# Altium schematic sheet [00] ESP8266 CH340.SchDoc (part 2 of 3)
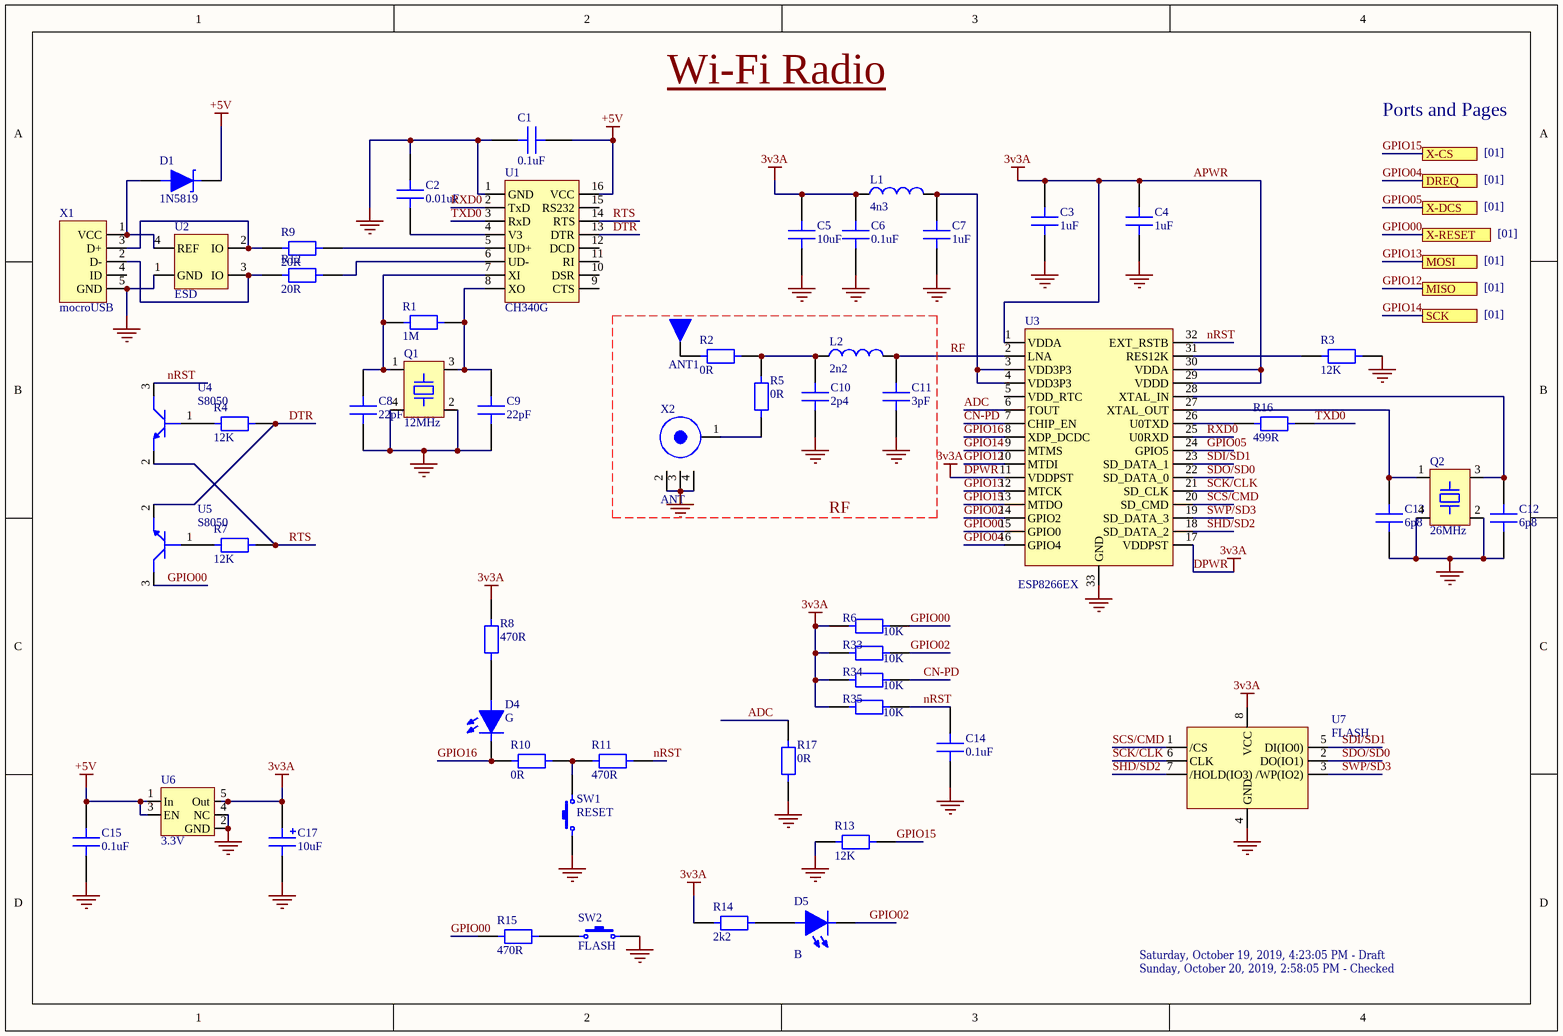
[diagram p1: [00] ESP8266 CH340.SchDoc]
## Library data of the parts
ANT1 = ANT WI-FI PCB 2.4GHz: ANT WIFI PCB TRACE ANTENNA 2.4GHz
C1 C15 = VJ0805Y104KXAAT: CAP CER 0.1uF 0805 50V X7R; Manufacturer: Vishay Vitramon; Capacitance: 100nF; Tolerance: 10%; Supplier 1: Digi-Key; Supplier Part Number 1: 720-1383-1-ND; Manufacturer Part Number: VJ0805Y104KXAAT; Stock 1: 145518; Mount: Surface Mount; Case/Package: 0805; Weight: 0.000194oz; Case Code (Metric): 2012; Case Code (Imperial): 0805; Min Operating Temperature: -55°C; Max Operating Temperature: 125°C; Package Quantity: 1; Packaging: Tape and Reel; Voltage Rating: 50V; Voltage Rating (DC): 50V; Dielectric: X7R; Termination: SMD/SMT; Voltage: 50V; Length: 2mm; Height: 1.45mm; Width: 0.049inch; Thickness: 0.057inch; Depth: 1.25mm; Radiation Hardening: No; REACH SVHC: Unknown; Lead Free: Lead Free; ComponentLink1URL: http://www.mouser.com/ds/2/427/vjcommercialseries-222796.pdf?src-supplier=Mouser; ComponentLink1Description: http://www.mouser.com/ds/2/427/vjcommercialseries-222796.pdf?src-supplier=Mouser; ComponentLink2URL: http://www.vishay.com/docs/45199/vjcommercialseries.pdf?src-supplier=Digi-Key; ComponentLink2Description: http://www.vishay.com/docs/45199/vjcommercialseries.pdf?src-supplier=Digi-Key; ComponentLink3URL: http://www.vishay.com/docs/45199/vjcommercialseries.pdf?src-supplier=Future+Electronics; ComponentLink3Description: http://www.vishay.com/docs/45199/vjcommercialseries.pdf?src-supplier=Future+Electronics
C2 = VJ0603Y103KXAAC: CAP CER 0.01uF 0603 10 nF 50 V ±10 % Tolerance X7R SMT Multilayer Ceramic Chip Capacitor; Manufacturer: Vishay Vitramon; Tolerance: 10%; Capacitance: 10nF; Voltage Rating: 50V; Supplier 1: Digi-Key; Supplier Part Number 1: 720-1376-1-ND; Manufacturer Part Number: VJ0603Y103KXAAC; Stock 1: 728512; Pricing 1: 1=0.26, 10=0.179, 100=0.1013, 500=0.0715, 1000=0.0625 (USD); Mount: Surface Mount; Case/Package: 0603; Number of Pins: 2; Weight: 7.1E-05oz; Case Code (Metric): 1608; Case Code (Imperial): 0603; Contact Plating: Tin,Matte; Min Operating Temperature: -55°C; Max Operating Temperature: 125°C; Packaging: Tape and Reel; Package Quantity: 4000; Voltage Rating (DC): 50V; Dielectric: X7R; Termination: SMD/SMT; Voltage: 50V; Length: 1.6mm; Height: 0.92mm; Width: 0.031inch; Thickness: 0.036inch; Depth: 0.8mm; Radiation Hardening: No; REACH SVHC: Unknown; Lead Free: Lead Free; ComponentLink1URL: http://www.farnell.com/datasheets/1805045.pdf?src-supplier=Element14; ComponentLink1Description: http://www.farnell.com/datasheets/1805045.pdf?src-supplier=Element14; ComponentLink2URL: http://www.farnell.com/datasheets/2049137.pdf?src-supplier=Element14; ComponentLink2Description: http://www.farnell.com/datasheets/2049137.pdf?src-supplier=Element14; ComponentLink3URL: http://www.farnell.com/datasheets/50102.pdf?src-supplier=Element14; ComponentLink3Description: http://www.farnell.com/datasheets/50102.pdf?src-supplier=Element14; ComponentLink4URL: http://www.vishay.com/docs/45051/vjvitramonpackaging.pdf?src-supplier=Digi-Key; ComponentLink4Description: http://www.vishay.com/docs/45051/vjvitramonpackaging.pdf?src-supplier=Digi-Key
C3 C4 C7 = VJ0603Y105KXJCW1BC: CAP CER 1uF 0603 16V X7R 10% SMD 125C Paper T/R; Manufacturer: Vishay Semiconductors; Dielectric Material: Tantalum; Supplier 1: Digi-Key; Supplier Part Number 1: 720-1852-1-ND; Manufacturer Part Number: VJ0603Y105KXJCW1BC; Stock 1: 970843; Pricing 1: 1=0.29, 10=0.196, 100=0.0991, 500=0.0678, 1000=0.06 (USD); Mount: Surface Mount; Case/Package: 0603; Min Operating Temperature: -55°C; Max Operating Temperature: 125°C; Capacitance: 1uF; Tolerance: 10%; Packaging: Tape and Reel; Dielectric: X7R; Voltage Rating (DC): 16V; Length: 1.6mm; Depth: 0.8mm; Radiation Hardening: No; Lead Free: Lead Free; ComponentLink1URL: http://www.vishay.com/docs/28548/vjw1bcbascomseries.pdf?src-supplier=Avnet; ComponentLink1Description: http://www.vishay.com/docs/28548/vjw1bcbascomseries.pdf?src-supplier=Avnet; ComponentLink2URL: http://www.vishay.com/docs/28548/vjw1bcbascomseries.pdf?src-supplier=Avnet+Europe; ComponentLink2Description: http://www.vishay.com/docs/28548/vjw1bcbascomseries.pdf?src-supplier=Avnet+Europe
C5 = C0603C106M9PACTU: CAP CER 10UF 0603 6.3V; Manufacturer: KEMET; Dielectric Material: Ceramic; Tolerance: 20%; Dielectric: X5R; Supplier 1: Digi-Key; Supplier Part Number 1: 399-5504-1-ND; Manufacturer Part Number: C0603C106M9PACTU; Stock 1: 97190; Pricing 1: 1=0.49, 10=0.34, 100=0.2042, 500=0.1531, 1000=0.1293 (USD); Mount: Surface Mount; Case/Package: 0603; Min Operating Temperature: -55°C; Max Operating Temperature: 85°C; Capacitance: 10uF; Packaging: Tape and Reel; Voltage: 6.3V; Termination: SMD/SMT; Length: 1.6mm; Height: 0.8mm; Depth: 0.8mm; Radiation Hardening: No; ComponentLink1URL: http://www.farnell.com/datasheets/2739682.pdf?src-supplier=Farnell; ComponentLink1Description: http://www.farnell.com/datasheets/2739682.pdf?src-supplier=Farnell; ComponentLink2URL: http://uk.rs-online.com/webdocs/1515/0900766b8151511d.pdf?src-supplier=RSComponents; ComponentLink2Description: http://uk.rs-online.com/webdocs/1515/0900766b8151511d.pdf?src-supplier=RSComponents; ComponentLink3URL: http://www.farnell.com/datasheets/1918694.pdf?src-supplier=Farnell; ComponentLink3Description: http://www.farnell.com/datasheets/1918694.pdf?src-supplier=Farnell; ComponentLink4URL: http://www.farnell.com/datasheets/2315129.pdf?src-supplier=RSComponents; ComponentLink4Description: http://www.farnell.com/datasheets/2315129.pdf?src-supplier=RSComponents; ComponentLink5URL: http://www.kemet.com/kemet/web/homepage/kechome.nsf/weben/ADB5E2666EC6BA90CA2570A50016092E/$file/KEM_C1005_Y5V_SMD.pdf?src-supplier=Avnet; ComponentLink5Description: http://www.kemet.com/kemet/web/homepage/kechome.nsf/weben/ADB5E2666EC6BA90CA2570A50016092E/$file/KEM_C1005_Y5V_SMD.pdf?src-supplier=Avnet; ComponentLink6URL: http://www.farnell.com/datasheets/2315129.pdf?src-supplier=Verical; ComponentLink6Description: http://www.farnell.com/datasheets/2315129.pdf?src-supplier=Verical; ComponentLink7URL: http://www.farnell.com/datasheets/2739682.pdf?src-supplier=Newark; ComponentLink7Description: http://www.farnell.com/datasheets/2739682.pdf?src-supplier=Newark; ComponentLink8URL: https://api.kemet.com/component-edge/download/datasheet/C0603C106M9PACTU.pdf?src-supplier=Digi-Key; ComponentLink8Description: https://api.kemet.com/component-edge/download/datasheet/C0603C106M9PACTU.pdf?src-supplier=Digi-Key; ComponentLink9URL: http://www.farnell.com/datasheets/2123796.pdf?src-supplier=Element14; ComponentLink9Description: http://www.farnell.com/datasheets/2123796.pdf?src-supplier=Element14; ComponentLink10URL: http://www.farnell.com/datasheets/2315129.pdf?src-supplier=Avnet+Asia; ComponentLink10Description: http://www.farnell.com/datasheets/2315129.pdf?src-supplier=Avnet+Asia; ComponentLink11URL: http://www.farnell.com/datasheets/2315129.pdf?src-supplier=Allied+Electronics; ComponentLink11Description: http://www.farnell.com/datasheets/2315129.pdf?src-supplier=Allied+Electronics; ComponentLink12URL: http://components.arrow.com/part/dataview/0323_00011321?src-supplier=Arrow+Europe; ComponentLink12Description: http://components.arrow.com/part/dataview/0323_00011321?src-supplier=Arrow+Europe; ComponentLink13URL: http://components.arrow.com/part/dataview/42932973S8313645N7429?src-supplier=Arrow; ComponentLink13Description: http://components.arrow.com/part/dataview/42932973S8313645N7429?src-supplier=Arrow; ComponentLink14URL: http://www.farnell.com/datasheets/2315129.pdf?src-supplier=Mouser; ComponentLink14Description: http://www.farnell.com/datasheets/2315129.pdf?src-supplier=Mouser; ComponentLink15URL: https://www.verical.com/server-webapp/html/getDatasheet?partID=353664&src-supplier=Verical; ComponentLink15Description: https://www.verical.com/server-webapp/html/getDatasheet?partID=353664&src-supplier=Verical; ComponentLink16URL: http://capacitoredge.kemet.com/capedge2/DataSheet?pn=C0603C106M9PAC7867&src-supplier=Avnet; ComponentLink16Description: http://capacitoredge.kemet.com/capedge2/DataSheet?pn=C0603C106M9PAC7867&src-supplier=Avnet; ComponentLink17URL: http://www.farnell.com/datasheets/2315129.pdf?src-supplier=Distrelec; ComponentLink17Description: http://www.farnell.com/datasheets/2315129.pdf?src-supplier=Distrelec; ComponentLink18URL: http://www.kemet.com/kemet/web/homepage/kechome.nsf/file/Commercial%20Ceramic%20Chips%20X5R%20Dielectric/$file/KEM_C1006_X5R_SMD.pdf?src-supplier=Element14; ComponentLink18Description: http://www.kemet.com/kemet/web/homepage/kechome.nsf/file/Commercial%20Ceramic%20Chips%20X5R%20Dielectric/$file/KEM_C1006_X5R_SMD.pdf?src-supplier=Element14; ComponentLink19URL: http://www.farnell.com/datasheets/2315129.pdf?src-supplier=TME; ComponentLink19Description: http://www.farnell.com/datasheets/2315129.pdf?src-supplier=TME; ComponentLink20URL: http://www.farnell.com/datasheets/2315129.pdf?src-supplier=TTI; ComponentLink20Description: http://www.farnell.com/datasheets/2315129.pdf?src-supplier=TTI; ComponentLink21URL: http://www.farnell.com/datasheets/2315129.pdf?src-supplier=Quest; ComponentLink21Description: http://www.farnell.com/datasheets/2315129.pdf?src-supplier=Quest
C6 C14 = VJ0603Y104JXXAC: CAP CER 0.1uF 0603- SMD/SMT .1UF 25V 5% 0603; Manufacturer: Vishay Vitramon; Capacitance: 100nF; Dielectric: X7R; Supplier 1: Digi-Key; Supplier Part Number 1: 720-1545-1-ND; Manufacturer Part Number: VJ0603Y104JXXAC; Stock 1: 126786; Pricing 1: 1=0.34, 10=0.233, 100=0.1397, 500=0.1048, 1000=0.0885 (USD); Mount: Surface Mount; Case/Package: 0603; Case Code (Metric): 1608; Case Code (Imperial): 0603; Min Operating Temperature: -55°C; Max Operating Temperature: 125°C; Package Quantity: 4000; Voltage Rating: 25V; Tolerance: 5%; Packaging: Tape and Reel; Voltage Rating (DC): 25V; Termination: SMD/SMT; Length: 1.6mm; Width: 0.031inch; Thickness: 0.036inch; Depth: 0.8mm; Radiation Hardening: No; ComponentLink1URL: http://www.vishay.com/docs/45199/vjcommercialseries.pdf?src-supplier=Digi-Key; ComponentLink1Description: http://www.vishay.com/docs/45199/vjcommercialseries.pdf?src-supplier=Digi-Key
C8 C9 = CBR06C220JAGAC: CAP CER 22PF 0603 250V C0G/NP0; Manufacturer: KEMET; Dielectric Material: Ceramic; Tolerance: 5%; Dielectric: C0G; Temperature Coefficient: 30ppm/°C; Supplier 1: Digi-Key; Supplier Part Number 1: 399-6187-1-ND; Manufacturer Part Number: CBR06C220JAGAC; Stock 1: 22390; Pricing 1: 1=0.98, 10=0.773, 100=0.5796, 500=0.4379, 1000=0.3864 (USD); Mount: Surface Mount; Case/Package: 0603; Weight: 7.1E-05oz; Case Code (Metric): 1608; Case Code (Imperial): 0603; Min Operating Temperature: -55°C; Max Operating Temperature: 125°C; Capacitance: 22pF; Voltage Rating: 250V; Packaging: Tape and Reel; Package Quantity: 1; Voltage Rating (DC): 250V; Termination: SMD/SMT; Voltage: 250V; Length: 1.6mm; Height: 0.8mm; Width: 0.031inch; Thickness: 0.034inch; Depth: 0.8mm; Radiation Hardening: No; REACH SVHC: No SVHC; ComponentLink1URL: http://www.farnell.com/datasheets/1446011.pdf?src-supplier=Element14; ComponentLink1Description: http://www.farnell.com/datasheets/1446011.pdf?src-supplier=Element14; ComponentLink2URL: http://uk.rs-online.com/webdocs/1528/0900766b81528b9f.pdf?src-supplier=RSComponents; ComponentLink2Description: http://uk.rs-online.com/webdocs/1528/0900766b81528b9f.pdf?src-supplier=RSComponents; ComponentLink3URL: https://search.kemet.com/component-edge/download/datasheet/CBR06C220JAGAC.pdf?src-supplier=Digi-Key; ComponentLink3Description: https://search.kemet.com/component-edge/download/datasheet/CBR06C220JAGAC.pdf?src-supplier=Digi-Key; ComponentLink4URL: https://api.kemet.com/component-edge/download/datasheet/CBR06C220JAGAC.pdf?src-supplier=Digi-Key; ComponentLink4Description: https://api.kemet.com/component-edge/download/datasheet/CBR06C220JAGAC.pdf?src-supplier=Digi-Key
C10 = CBR04C249B5GAC: CAP CER 2.4pF 0402 50V C0G 0.1pF SMD 0402 125°C Paper T/R; Manufacturer: KEMET; Supplier 1: Digi-Key; Supplier Part Number 1: 399-16068-1-ND; Manufacturer Part Number: CBR04C249B5GAC; Stock 1: 6688; Pricing 1: 1=0.18, 10=0.125, 100=0.0635, 500=0.0434, 1000=0.0384, 2500=0.0367, 5000=0.0334 (USD); Case/Package: 0402; Case Code (Metric): 1005; Case Code (Imperial): 0402; Max Operating Temperature: 125°C; Capacitance: 2.4pF; Voltage Rating: 50V; Packaging: Cut Tape; Voltage Rating (DC): 50V; REACH SVHC: No SVHC; ComponentLink1URL: http://www.farnell.com/datasheets/1446011.pdf?src-supplier=Element14; ComponentLink1Description: http://www.farnell.com/datasheets/1446011.pdf?src-supplier=Element14; ComponentLink2URL: http://www.farnell.com/datasheets/2761969.pdf?src-supplier=Farnell; ComponentLink2Description: http://www.farnell.com/datasheets/2761969.pdf?src-supplier=Farnell
C11 = CBR04C309B5GAC: CAP CER 3PF 0402 50V NP0; Manufacturer: KEMET; Dielectric: C0G; Supplier 1: Digi-Key; Supplier Part Number 1: 399-13245-1-ND; Manufacturer Part Number: CBR04C309B5GAC; Stock 1: 1768; Pricing 1: 1=0.19, 10=0.137, 100=0.0646, 500=0.0453, 1000=0.0375, 2500=0.0349, 5000=0.0319 (USD); Mount: Surface Mount; Case/Package: 0402; Weight: 2.3E-05oz; Case Code (Imperial): 0402; Case Code (Metric): 1005; Min Operating Temperature: -55°C; Max Operating Temperature: 125°C; Capacitance: 3pF; Voltage Rating (DC): 50V; Packaging: Tape and Reel; Package Quantity: 10000; Voltage Rating: 50V; Termination: SMD/SMT; Length: 0.039inch; Height: 0.5mm; Width: 0.02inch; Thickness: 0.022inch; ComponentLink1URL: http://www.mouser.com/ds/2/212/KEM_C1030_CBR_SMD-1101233.pdf?src-supplier=Mouser; ComponentLink1Description: http://www.mouser.com/ds/2/212/KEM_C1030_CBR_SMD-1101233.pdf?src-supplier=Mouser; ComponentLink2URL: http://www.kemet.com/Lists/ProductCatalog/Attachments/490/KEM_C1030_CBR_SMD.pdf?src-supplier=Digi-Key; ComponentLink2Description: http://www.kemet.com/Lists/ProductCatalog/Attachments/490/KEM_C1030_CBR_SMD.pdf?src-supplier=Digi-Key
C12 C13 = CBR06C689BAGAC: CAP CER 6.8PF 0603 250V C0G/NP0; Manufacturer: KEMET; Supplier 1: Digi-Key; Supplier Part Number 1: 399-8744-1-ND; Manufacturer Part Number: CBR06C689BAGAC; Stock 1: 20; Pricing 1: 1=0.78, 10=0.549, 100=0.3614, 500=0.2677, 1000=0.2275 (USD); Mount: Surface Mount; Case/Package: 0603; Case Code (Metric): 1608; Case Code (Imperial): 0603; Min Operating Temperature: -55°C; Max Operating Temperature: 125°C; Package Quantity: 1; Capacitance: 6.8pF; Voltage Rating: 250V; Packaging: Tape and Reel; Length: 0.063inch; Width: 0.031inch; Thickness: 0.034inch; ComponentLink1URL: https://search.kemet.com/component-edge/download/datasheet/CBR06C689BAGAC.pdf?src-supplier=Digi-Key; ComponentLink1Description: https://search.kemet.com/component-edge/download/datasheet/CBR06C689BAGAC.pdf?src-supplier=Digi-Key; ComponentLink2URL: https://api.kemet.com/component-edge/download/datasheet/CBR06C689BAGAC.pdf?src-supplier=Digi-Key; ComponentLink2Description: https://api.kemet.com/component-edge/download/datasheet/CBR06C689BAGAC.pdf?src-supplier=Digi-Key
C17 = 293D106X96R3A2TE3: CAP TANT 10UF 1206 6.3V 10%; Manufacturer: Vishay Sprague; Dielectric Material: Tantalum; ESR (Equivalent Series Resistance): 3.4R; Ripple Current: 150mA; Leakage Current: 600nA; Polarity: Polar; Dissipation Factor: 6%; Q Factor: 6; Supplier 1: Digi-Key; Supplier Part Number 1: 718-1126-1-ND; Manufacturer Part Number: 293D106X96R3A2TE3; Stock 1: 57716; Pricing 1: 1=0.3, 10=0.212, 100=0.127, 500=0.0952, 1000=0.0804 (USD); Mount: Surface Mount,PCB; Case/Package: 1206; Case Code (Metric): 3216; Case Code (Imperial): 1206; Min Operating Temperature: -55°C; Max Operating Temperature: 125°C; Capacitance: 10uF; Tolerance: 10%; Voltage Rating: 6.3V; Packaging: Tape and Reel; Voltage Rating (DC): 6.3V; Package Quantity: 1; Termination: SMD/SMT; Voltage: 6.3V; Features: General Purpose; Length: 3.2mm; Height: 1.6mm; Width: 1.6mm; Height - Seated (Max): 0.071inch; Depth: 1.6mm; Radiation Hardening: No; REACH SVHC: Unknown; Lead Free: Lead Free; ComponentLink1URL: http://www.vishay.com/docs/40002/293d.pdf?src-supplier=Avnet; ComponentLink1Description: http://www.vishay.com/docs/40002/293d.pdf?src-supplier=Avnet; ComponentLink2URL: http://www.farnell.com/datasheets/2045658.pdf?src-supplier=Element14; ComponentLink2Description: http://www.farnell.com/datasheets/2045658.pdf?src-supplier=Element14; ComponentLink3URL: http://documents.rs-components.com/techlib://itc_doclist_GB.htm?stockno=6843913&src-supplier=RSComponents; ComponentLink3Description: http://documents.rs-components.com/techlib://itc_doclist_GB.htm?stockno=6843913&src-supplier=RSComponents; ComponentLink4URL: https://www.alliedelec.com/m/d/7dc9f301682605e5c5665c787edb7bb9.pdf?src-supplier=Allied+Electronics; ComponentLink4Description: https://www.alliedelec.com/m/d/7dc9f301682605e5c5665c787edb7bb9.pdf?src-supplier=Allied+Electronics; ComponentLink5URL: http://www.vishay.com/docs/40002/293d.pdf?src-supplier=Digi-Key; ComponentLink5Description: http://www.vishay.com/docs/40002/293d.pdf?src-supplier=Digi-Key; ComponentLink6URL: http://www.mouser.com/ds/2/427/293d-239871.pdf?src-supplier=Mouser; ComponentLink6Description: http://www.mouser.com/ds/2/427/293d-239871.pdf?src-supplier=Mouser; ComponentLink7URL: http://www.vishay.com/docs/40002/293d.pdf?src-supplier=Avnet+Europe; ComponentLink7Description: http://www.vishay.com/docs/40002/293d.pdf?src-supplier=Avnet+Europe; ComponentLink8URL: http://www.farnell.com/datasheets/438417.pdf?src-supplier=Element14; ComponentLink8Description: http://www.farnell.com/datasheets/438417.pdf?src-supplier=Element14; Category: Capacitors
D1 = 1N5819HW-7-F: DIODE SCHOTTKY 40V 1A SOD123; Manufacturer: Diodes; Forward Voltage: 450mV; Max Power Dissipation: 450mW; Peak Reverse Current: 50uA; Element Configuration: Single; Max Forward Surge Current (Ifsm): 25A; Polarity: Standard; Capacitance: 110pF; Supplier 1: Digi-Key; Supplier Part Number 1: 1N5819HW-FDICT-ND; Manufacturer Part Number: 1N5819HW-7-F; Stock 1: 454743; Case/Package: SOD-123-2; Number of Pins: 2; Weight: 0.000353oz; Contact Plating: Tin,Matte; Min Operating Temperature: -65°C; Max Operating Temperature: 125°C; Package Quantity: 3000; Forward Current: 1A; Packaging: Tape and Reel; Average Rectified Current: 1A; Max Repetitive Reverse Voltage (Vrrm): 40V; Peak Non-Repetitive Surge Current: 25A; Termination: SMD/SMT; Voltage Rating (DC): 40V; Current Rating: 1A; Output Current: 1A; Max Reverse Voltage (DC): 40V; Length: 2.85mm; Height: 1.25mm; Width: 1.7mm; Radiation Hardening: No; REACH SVHC: No SVHC; Lead Free: Lead Free; ComponentLink1URL: http://www.diodes.com/datasheets/ds30217.pdf?src-supplier=Future+Electronics; ComponentLink1Description: http://www.diodes.com/datasheets/ds30217.pdf?src-supplier=Future+Electronics; ComponentLink2URL: https://www.diodes.com/assets/Datasheets/ds30217.pdf?src-supplier=Digi-Key; ComponentLink2Description: https://www.diodes.com/assets/Datasheets/ds30217.pdf?src-supplier=Digi-Key; ComponentLink3URL: http://www.farnell.com/datasheets/2238341.pdf?src-supplier=Element14; ComponentLink3Description: http://www.farnell.com/datasheets/2238341.pdf?src-supplier=Element14; ComponentLink4URL: http://www.jameco.com/Jameco/Products/ProdDS/1538419.pdf?src-supplier=Jameco; ComponentLink4Description: http://www.jameco.com/Jameco/Products/ProdDS/1538419.pdf?src-supplier=Jameco; ComponentLink5URL: http://www.farnell.com/datasheets/2238341.pdf?src-supplier=Avnet; ComponentLink5Description: http://www.farnell.com/datasheets/2238341.pdf?src-supplier=Avnet; ComponentLink6URL: http://www.farnell.com/datasheets/2238341.pdf?src-supplier=Avnet+Europe; ComponentLink6Description: http://www.farnell.com/datasheets/2238341.pdf?src-supplier=Avnet+Europe
D4 = LTST-C194KGKT: LED GREEN 0603 574nm 2-Pin Chip LED T/R; Manufacturer: Vishay Lite-On; Lens Color: Colorless; Power Rating: 75mW; Luminous Intensity: 112mcd; Viewing Angle: 130°; Forward Voltage: 2.4V; Forward Current: 30mA; Lens Style: Diffused,Colorless,Rectangular; Lens Transparency: Clear; Test Current: 20mA; Dominant Wavelength: 576.5nm; Number of Elements: 1; Reverse Voltage: 5V; Supplier 1: Digi-Key; Supplier Part Number 1: 160-1834-1-ND; Manufacturer Part Number: LTST-C194KGKT; Stock 1: 36702; Pricing 1: 1=0.39, 10=0.283, 100=0.1256, 500=0.0879, 1000=0.0722, 2500=0.0628 (USD); Mount: Surface Mount; Case/Package: 0603; Number of Pins: 2; Color: Green; Case Code (Metric): 1608; Case Code (Imperial): 0603; Min Operating Temperature: -30°C; Max Operating Temperature: 85°C; Packaging: Tape and Reel; Package Quantity: 3000; Illumination Color: Green; Power Dissipation: 75mW; Number of LEDs: 1; Length: 1.6mm; Height: 0.35mm; Width: 0.8mm; Depth: 0.8mm; Radiation Hardening: No; Lead Free: Lead Free; ComponentLink1URL: http://optoelectronics.liteon.com/upload/download/DS22-2010-0197/LTST-C194KGKT.PDF?src-supplier=Digi-Key; ComponentLink1Description: http://optoelectronics.liteon.com/upload/download/DS22-2010-0197/LTST-C194KGKT.PDF?src-supplier=Digi-Key; ComponentLink2URL: https://www.verical.com/server-webapp/html/getDatasheet?partID=708771&src-supplier=Verical; ComponentLink2Description: https://www.verical.com/server-webapp/html/getDatasheet?partID=708771&src-supplier=Verical
D5 = LTST-C193TBKT-5A: LED BLUE 0603 CLEAR CHIP SMD; Manufacturer: Vishay Lite-On; Lens Color: Colorless; Forward Current: 20mA; Forward Voltage: 2.8V; Luminous Intensity: 15mcd; Viewing Angle: 130°; Lens Style: Diffused,Colorless,Rectangular,Clear; Dominant Wavelength: 475nm; Test Current: 5mA; Number of Elements: 1; Power Dissipation: 76mW; Reverse Voltage: 5V; Supplier 1: Digi-Key; Supplier Part Number 1: 160-1827-1-ND; Manufacturer Part Number: LTST-C193TBKT-5A; Stock 1: 114316; Pricing 1: 1=0.45, 10=0.32, 100=0.1424, 500=0.0997, 1000=0.0819, 2500=0.0712 (USD); Mount: Surface Mount; Case/Package: 0603; Number of Pins: 2; Color: Blue; Case Code (Metric): 1608; Case Code (Imperial): 0603; Min Operating Temperature: -20°C; Max Operating Temperature: 80°C; Packaging: Tape and Reel; Package Quantity: 1; Illumination Color: Blue; Lens Transparency: Clear; Number of LEDs: 1; Length: 1.6mm; Height: 0.35mm; Width: 0.8mm; Depth: 0.8mm; Radiation Hardening: No; Lead Free: Lead Free; ComponentLink1URL: http://www.mouser.com/ds/2/239/Lite-On-LTST-C193TBKT-5A-187386.pdf?src-supplier=Mouser; ComponentLink1Description: http://www.mouser.com/ds/2/239/Lite-On-LTST-C193TBKT-5A-187386.pdf?src-supplier=Mouser; ComponentLink2URL: https://media.digikey.com/pdf/Data%20Sheets/Lite-On%20PDFs/LTST-C193TBKT-5A.pdf?src-supplier=Digi-Key; ComponentLink2Description: https://media.digikey.com/pdf/Data%20Sheets/Lite-On%20PDFs/LTST-C193TBKT-5A.pdf?src-supplier=Digi-Key; ComponentLink3URL: https://www.verical.com/server-webapp/html/getDatasheet?partID=293056&src-supplier=Verical; ComponentLink3Description: https://www.verical.com/server-webapp/html/getDatasheet?partID=293056&src-supplier=Verical; ComponentLink4URL: http://uk.rs-online.com/webdocs/0dc0/0900766b80dc0554.pdf?src-supplier=RSComponents; ComponentLink4Description: http://uk.rs-online.com/webdocs/0dc0/0900766b80dc0554.pdf?src-supplier=RSComponents; ComponentLink5URL: http://www1.futureelectronics.com/doc/LITE-ON/LTST-C193TBKT-5A.pdf?src-supplier=Future+Electronics; ComponentLink5Description: http://www1.futureelectronics.com/doc/LITE-ON/LTST-C193TBKT-5A.pdf?src-supplier=Future+Electronics
L1 = LQW18AN4N3D00D: IND SMD 4.3nH 0603 850mA FIXED 59 MOHM; Manufacturer: Murata; Core Material: Non-Magnetic,Ferrite; Q Factor: 35; Self Resonant Frequency: 6GHz; Shielding: Unshielded; DC Resistance (DCR): 59mR; Test Frequency: 100MHz; Supplier 1: Digi-Key; Supplier Part Number 1: 490-1161-1-ND; Manufacturer Part Number: LQW18AN4N3D00D; Stock 1: 13187; Pricing 1: 1=0.17, 10=0.155, 100=0.1035, 500=0.0863, 1000=0.0725 (USD); Mount: Surface Mount; Case/Package: 0603; Weight: 0.000106oz; Case Code (Metric): 1608; Case Code (Imperial): 0603; Min Operating Temperature: -55°C; Max Operating Temperature: 125°C; Packaging: Tape and Reel; Inductance: 4.3nH; Package Quantity: 4000; Current Rating: 850mA; Max DC Current: 850mA; Termination: SMD/SMT; Composition: Wirewound; DC Current: 850mA; Military Standard: Not; Length: 1.6mm; Height: 0.8mm; Width: 0.8mm; Height - Seated (Max): 0.039inch; Depth: 1mm; Radiation Hardening: No; Lead Free: Lead Free; ComponentLink1URL: http://uk.rs-online.com/webdocs/1256/0900766b81256268.pdf?src-supplier=RSComponents; ComponentLink1Description: http://uk.rs-online.com/webdocs/1256/0900766b81256268.pdf?src-supplier=RSComponents; ComponentLink2URL: http://www.murata.com/~/media/webrenewal/support/library/catalog/products/inductor/chip/o05e.ashx?src-supplier=Digi-Key; ComponentLink2Description: http://www.murata.com/~/media/webrenewal/support/library/catalog/products/inductor/chip/o05e.ashx?src-supplier=Digi-Key; ComponentLink3URL: https://search.murata.co.jp/Ceramy/image/img/P02/JELF243A-0024.pdf?src-supplier=Digi-Key; ComponentLink3Description: https://search.murata.co.jp/Ceramy/image/img/P02/JELF243A-0024.pdf?src-supplier=Digi-Key
L2 = L-07C2N2SV6T: IND SMD 2.2NH 0402 300MA 160 MOHM; Manufacturer: Johanson; Core Material: Ceramic; Q Factor: 8; Shielding: Unshielded; DC Resistance (DCR): 160mR; Self Resonant Frequency: 12GHz; Test Frequency: 100MHz; Supplier 1: Digi-Key; Supplier Part Number 1: 712-1414-1-ND; Manufacturer Part Number: L-07C2N2SV6T; Stock 1: 253343; Pricing 1: 1=0.1, 10=0.047, 100=0.0311, 500=0.0259, 1000=0.0217, 2500=0.0186 (USD); Mount: Surface Mount; Case/Package: 0402; Number of Pins: 2; Case Code (Metric): 1005; Case Code (Imperial): 0402; Min Operating Temperature: -40°C; Max Operating Temperature: 100°C; Packaging: Tape and Reel; Package Quantity: 1; Current Rating: 300mA; Inductance: 2.2nH; Max DC Current: 300mA; Termination: SMD/SMT; DC Current: 300mA; Military Standard: Not; Length: 1.1mm; Height: 0.5mm; Width: 0.5mm; Height - Seated (Max): 0.024inch; Depth: 0.6mm; Radiation Hardening: No; REACH SVHC: No SVHC; ComponentLink1URL: http://www.farnell.com/datasheets/1168792.pdf?src-supplier=Element14; ComponentLink1Description: http://www.farnell.com/datasheets/1168792.pdf?src-supplier=Element14
Q1 = ABM8-12.000MHZ-20-B1U-T: CRYSTAL SMD 12MHz ±10ppm (Tol) ±10ppm (Stability) 20pF FUND 120Ohm 4-Pin Ultra Mini-CSMD T/R; Manufacturer: Abracon; Supplier 1: Digi-Key; Supplier Part Number 1: 535-14963-1-ND; Manufacturer Part Number: ABM8-12.000MHZ-20-B1U-T; Stock 1: 970; Pricing 1: 1=0.57, 10=0.473, 50=0.4258, 100=0.3784, 500=0.3595 (USD); ComponentLink1URL: http://datasheet.octopart.com/ABM8-12.000MHZ-20-B1U-T-Abracon-datasheet-103059652.pdf?src-supplier=Sager+Electronics; ComponentLink1Description: http://datasheet.octopart.com/ABM8-12.000MHZ-20-B1U-T-Abracon-datasheet-103059652.pdf?src-supplier=Sager+Electronics
Q2 = ABM8-26.000MHZ-10-1-U-T: CRYSTAL SMD 26MHz 3.2mm ±10ppm (Tol) ±10ppm (Stability) 10pF FUND 50Ohm 4-Pin Ultra Mini-CSMD T/R; Manufacturer: Abracon; ESR (Equivalent Series Resistance): 50R; Supplier 1: Digi-Key; Supplier Part Number 1: 300-8230-1-ND; Manufacturer Part Number: ABM8-26.000MHZ-10-1-U-T; Stock 1: 88292; Pricing 1: 1=1.09, 10=0.961, 50=0.8988, 100=0.7942, 500=0.7524 (USD); Mount: Surface Mount; Case/Package: CSMD; Number of Pins: 4; Min Operating Temperature: -10°C; Max Operating Temperature: 60°C; Package Quantity: 1000; Packaging: Tape and Reel; Frequency Tolerance: 10ppm; Load Capacitance: 10pF; Frequency: 26MHz; Tolerance: 10ppm; Frequency Stability: 10ppm; Termination: SMD/SMT; Composition: Ceramic; Series Resistance: 50R; Length: 3.2mm; Height: 0.031inch; Width: 2.5mm; Depth: 2.5mm; Lead Free: Lead Free; REACH SVHC: No SVHC; ComponentLink1URL: http://www.abracon.com/Resonators/abm8.pdf?src-supplier=Avnet; ComponentLink1Description: http://www.abracon.com/Resonators/abm8.pdf?src-supplier=Avnet; ComponentLink2URL: https://www.verical.com/server-webapp/html/getDatasheet?partID=719798&src-supplier=Verical; ComponentLink2Description: https://www.verical.com/server-webapp/html/getDatasheet?partID=719798&src-supplier=Verical; ComponentLink3URL: http://www.abracon.com/Resonators/abm8.pdf?src-supplier=Digi-Key; ComponentLink3Description: http://www.abracon.com/Resonators/abm8.pdf?src-supplier=Digi-Key; ComponentLink4URL: https://abracon.com/Support/PackageDrawing/Resonators/ABM8.PDF?src-supplier=Digi-Key; ComponentLink4Description: https://abracon.com/Support/PackageDrawing/Resonators/ABM8.PDF?src-supplier=Digi-Key
R1 = CRCW06031M00FKEA: RES SMD 1M 0603 1% 1/10W; Manufacturer: Vishay; Power Rating: 100mW; Resistance: 1MR; Voltage Rating: 75V; Temperature Coefficient: 100ppm/°C; Supplier 1: Digi-Key; Supplier Part Number 1: 541-1.00MHCT-ND; Manufacturer Part Number: CRCW06031M00FKEA; Stock 1: 466723; Pricing 1: 1=0.1, 10=0.036, 100=0.0146, 1000=0.0065, 2500=0.0057 (USD); Mount: Surface Mount; Case/Package: 0603; Number of Pins: 2; Weight: 7.1E-05oz; Case Code (Imperial): 0603; Case Code (Metric): 1608; Contact Plating: Tin; Min Operating Temperature: -55°C; Max Operating Temperature: 155°C; Tolerance: 1%; Packaging: Tape and Reel; Composition: Thick Film; Package Quantity: 10; Number of Terminations: 2; Termination: SMD/SMT; Military Standard: Not; Voltage Rating (DC): 75V; Max Power Dissipation: 100mW; Features: Automotive AEC-Q200; Length: 1.55mm; Height: 0.45mm; Width: 0.85mm; Depth: 0.85mm; Radiation Hardening: No; REACH SVHC: Unknown; Lead Free: Lead Free; ComponentLink1URL: http://uk.rs-online.com/webdocs/0d98/0900766b80d98afc.pdf?src-supplier=RSComponents; ComponentLink1Description: http://uk.rs-online.com/webdocs/0d98/0900766b80d98afc.pdf?src-supplier=RSComponents; ComponentLink2URL: https://www.distrelec.biz/Web/Downloads/a_/en/flD-CRCW-e3_data_en.pdf?mime=application%2Fpdf&src-supplier=Distrelec; ComponentLink2Description: https://www.distrelec.biz/Web/Downloads/a_/en/flD-CRCW-e3_data_en.pdf?mime=application%2Fpdf&src-supplier=Distrelec; ComponentLink3URL: http://www.vishay.com/docs/20035/dcrcwe3.pdf?src-supplier=Digi-Key; ComponentLink3Description: http://www.vishay.com/docs/20035/dcrcwe3.pdf?src-supplier=Digi-Key; ComponentLink4URL: http://www.vishay.com/docs/20035/dcrcwe3.pdf?src-supplier=Future+Electronics; ComponentLink4Description: http://www.vishay.com/docs/20035/dcrcwe3.pdf?src-supplier=Future+Electronics; ComponentLink5URL: http://www.farnell.com/datasheets/2310790.pdf?src-supplier=Element14; ComponentLink5Description: http://www.farnell.com/datasheets/2310790.pdf?src-supplier=Element14; ComponentLink6URL: http://www.farnell.com/datasheets/125364.pdf?src-supplier=Element14; ComponentLink6Description: http://www.farnell.com/datasheets/125364.pdf?src-supplier=Element14
R2 R5 = CRCW04020000Z0ED: RES SMD 0R 0402 JUMPER 1/16W; Manufacturer: Vishay; Resistance: 0mR; Tolerance: 5%; Power Rating: 63mW; Voltage Rating: 50V; Temperature Coefficient: 100ppm/°C; Supplier 1: Digi-Key; Supplier Part Number 1: 541-0.0JCT-ND; Manufacturer Part Number: CRCW04020000Z0ED; Stock 1: 2460113; Pricing 1: 1=0.1, 10=0.034, 25=0.0244, 50=0.0186, 100=0.0138, 250=0.0105, 500=0.0084, 1000=0.0062, 5000=0.0044 (USD); Mount: Surface Mount; Case/Package: 0402; Weight: 2.3E-05oz; Case Code (Imperial): 0402; Case Code (Metric): 1005; Contact Plating: Tin; Min Operating Temperature: -55°C; Max Operating Temperature: 155°C; Packaging: Tape and Reel; Package Quantity: 1; Composition: Thick Film; Termination: SMD/SMT; Number of Terminations: 2; Military Standard: Not; Max Power Dissipation: 63mW; Voltage Rating (DC): 50V; Features: Automotive AEC-Q200; Length: 1mm; Height: 0.35mm; Width: 0.5mm; Depth: 0.5mm; Radiation Hardening: No; REACH SVHC: Unknown; Lead Free: Lead Free; ComponentLink1URL: http://www.vishay.com/docs/20035/dcrcwe3.pdf?src-supplier=Avnet+Europe; ComponentLink1Description: http://www.vishay.com/docs/20035/dcrcwe3.pdf?src-supplier=Avnet+Europe; ComponentLink2URL: http://www.vishay.com/docs/20035/dcrcwe3.pdf?src-supplier=Avnet; ComponentLink2Description: http://www.vishay.com/docs/20035/dcrcwe3.pdf?src-supplier=Avnet; ComponentLink3URL: http://www.vishay.com/docs/20035/dcrcwe3.pdf?src-supplier=Digi-Key; ComponentLink3Description: http://www.vishay.com/docs/20035/dcrcwe3.pdf?src-supplier=Digi-Key; ComponentLink4URL: http://www.farnell.com/datasheets/2793682.pdf?src-supplier=Element14; ComponentLink4Description: http://www.farnell.com/datasheets/2793682.pdf?src-supplier=Element14; ComponentLink5URL: http://www.vishay.com/docs/20035/dcrcwe3.pdf?src-supplier=Allied+Electronics; ComponentLink5Description: http://www.vishay.com/docs/20035/dcrcwe3.pdf?src-supplier=Allied+Electronics; ComponentLink6URL: https://www.distrelec.biz/Web/Downloads/a_/en/flD-CRCW-e3_data_en.pdf?mime=application%2Fpdf&src-supplier=Distrelec; ComponentLink6Description: https://www.distrelec.biz/Web/Downloads/a_/en/flD-CRCW-e3_data_en.pdf?mime=application%2Fpdf&src-supplier=Distrelec
R3 R4 R7 R13 = CRCW060312K0FKEAC: RES SMD 12K 0603 1% 1/10W; Manufacturer: Vishay; Resistance: 12kR; Max Power Dissipation: 100mW; Temperature Coefficient: 100ppm/°C; Supplier 1: Digi-Key; Supplier Part Number 1: 541-4046-1-ND; Manufacturer Part Number: CRCW060312K0FKEAC; Stock 1: 84165; Pricing 1: 1=0.1, 10=0.036, 100=0.0146, 1000=0.0065, 2500=0.0057 (USD); Case/Package: 0603; Case Code (Imperial): 0603; Case Code (Metric): 1608; Min Operating Temperature: -55°C; Max Operating Temperature: 155°C; Composition: Thick Film; Packaging: Cut Tape; Tolerance: 1%; Number of Terminations: 2; ComponentLink1URL: http://www.vishay.com/docs/28773/crcwce3.pdf?src-supplier=Digi-Key; ComponentLink1Description: http://www.vishay.com/docs/28773/crcwce3.pdf?src-supplier=Digi-Key
R6 R33-R35 = CRCW060310K0FKEA: RES SMD 10K 0603 1% 1/10W; Manufacturer: Vishay; Resistance: 10kR; Power Rating: 100mW; Voltage Rating: 75V; Temperature Coefficient: 100ppm/°C; Supplier 1: Digi-Key; Supplier Part Number 1: 541-10.0KHCT-ND; Manufacturer Part Number: CRCW060310K0FKEA; Stock 1: 2959816; Pricing 1: 1=0.1, 10=0.036, 100=0.0146, 1000=0.0065, 2500=0.0057 (USD); Case/Package: 0603; Number of Pins: 2; Weight: 7.1E-05oz; Case Code (Metric): 1608; Case Code (Imperial): 0603; Contact Plating: Tin,Lead; Min Operating Temperature: -55°C; Max Operating Temperature: 155°C; Tolerance: 1%; Packaging: Tape and Reel; Package Quantity: 10; Composition: Thick Film; Number of Terminations: 2; Military Standard: Not; Termination: SMD/SMT; Max Power Dissipation: 100mW; Voltage Rating (DC): 75V; Features: Automotive AEC-Q200; Length: 1.55mm; Height: 0.45mm; Width: 0.033inch; Depth: 0.85mm; Radiation Hardening: No; REACH SVHC: Unknown; Lead Free: Lead Free; ComponentLink1URL: http://www.vishay.com/docs/20008/dcrcw.pdf?src-supplier=Avnet+Europe; ComponentLink1Description: http://www.vishay.com/docs/20008/dcrcw.pdf?src-supplier=Avnet+Europe; ComponentLink2URL: https://www.verical.com/server-webapp/html/getDatasheet?partID=86831&src-supplier=Verical; ComponentLink2Description: https://www.verical.com/server-webapp/html/getDatasheet?partID=86831&src-supplier=Verical; ComponentLink3URL: http://www.farnell.com/datasheets/2310790.pdf?src-supplier=Allied+Electronics; ComponentLink3Description: http://www.farnell.com/datasheets/2310790.pdf?src-supplier=Allied+Electronics; ComponentLink4URL: http://www.vishay.com/docs/20035/dcrcwe3.pdf?src-supplier=Digi-Key; ComponentLink4Description: http://www.vishay.com/docs/20035/dcrcwe3.pdf?src-supplier=Digi-Key; ComponentLink5URL: http://www.farnell.com/datasheets/2310790.pdf?src-supplier=Mouser; ComponentLink5Description: http://www.farnell.com/datasheets/2310790.pdf?src-supplier=Mouser; ComponentLink6URL: http://www.farnell.com/datasheets/2310790.pdf?src-supplier=Element14; ComponentLink6Description: http://www.farnell.com/datasheets/2310790.pdf?src-supplier=Element14; ComponentLink7URL: http://www.farnell.com/datasheets/2310790.pdf?src-supplier=Avnet; ComponentLink7Description: http://www.farnell.com/datasheets/2310790.pdf?src-supplier=Avnet; ComponentLink8URL: http://www.vishay.com/docs/20035/dcrcwe3.pdf?src-supplier=Future+Electronics; ComponentLink8Description: http://www.vishay.com/docs/20035/dcrcwe3.pdf?src-supplier=Future+Electronics; ComponentLink9URL: http://uk.rs-online.com/webdocs/0d98/0900766b80d98afc.pdf?src-supplier=RSComponents; ComponentLink9Description: http://uk.rs-online.com/webdocs/0d98/0900766b80d98afc.pdf?src-supplier=RSComponents; ComponentLink10URL: http://www.farnell.com/datasheets/2310790.pdf?src-supplier=Distrelec; ComponentLink10Description: http://www.farnell.com/datasheets/2310790.pdf?src-supplier=Distrelec
R8 R11 R15 = CRCW0603470RFKEAC: RES SMD 470 0603 1% 1/10W; Manufacturer: Vishay; Power Rating: 100mW; Supplier 1: Digi-Key; Supplier Part Number 1: 541-4038-1-ND; Manufacturer Part Number: CRCW0603470RFKEAC; Stock 1: 239653; Pricing 1: 1=0.1, 10=0.036, 100=0.0146, 1000=0.0065, 2500=0.0057 (USD); Case/Package: 0603; Resistance: 470R; Tolerance: 1%; Lead Free: Lead Free; ComponentLink1URL: http://www.vishay.com/docs/28773/crcwce3.pdf?src-supplier=Digi-Key; ComponentLink1Description: http://www.vishay.com/docs/28773/crcwce3.pdf?src-supplier=Digi-Key
R9 R12 = CRCW060320R0FKEAHP: RES SMD 20 0603 1% 1/4W; Manufacturer: Vishay Dale; Power Rating: 250mW; Temperature Coefficient: 100ppm/°C; Voltage Rating: 75V; Supplier 1: Digi-Key; Supplier Part Number 1: 541-20.0SCT-ND; Manufacturer Part Number: CRCW060320R0FKEAHP; Stock 1: 2361; Pricing 1: 1=0.18, 10=0.149, 100=0.0581, 1000=0.0243, 2500=0.0223 (USD); Mount: Surface Mount; Case/Package: 0603; Weight: 7.1E-05oz; Case Code (Metric): 1608; Case Code (Imperial): 0603; Contact Plating: Tin; Min Operating Temperature: -55°C; Max Operating Temperature: 155°C; Resistance: 20R; Tolerance: 1%; Packaging: Tape and Reel; Package Quantity: 10; Composition: Thick Film; Number of Terminations: 2; Max Power Dissipation: 250mW; Features: Automotive AEC-Q200; Termination: Wraparound; Length: 1.6mm; Height: 0.45mm; Width: 0.033inch; Depth: 0.85mm; Radiation Hardening: No; Lead Free: Lead Free; ComponentLink1URL: http://www.vishay.com/docs/20043/crcwhpe3.pdf?src-supplier=Avnet; ComponentLink1Description: http://www.vishay.com/docs/20043/crcwhpe3.pdf?src-supplier=Avnet; ComponentLink2URL: http://www.vishay.com/docs/20043/crcwhpe3.pdf?src-supplier=Digi-Key; ComponentLink2Description: http://www.vishay.com/docs/20043/crcwhpe3.pdf?src-supplier=Digi-Key; ComponentLink3URL: http://www.vishay.com/doc?20043?src-supplier=Mouser; ComponentLink3Description: http://www.vishay.com/doc?20043?src-supplier=Mouser
R10 R17 = CRCW0603-0000Z0EA: RES SMD 0R 0603 JUMPER PU=5000 ST, CRCW06030000Z0EA, Vishay; Resistance: 0mR; Power Rating: 100mW; Voltage Rating: 75V; Tolerance: 5%; Temperature Coefficient: 100ppm/°C; Current Rating: 2A; Supplier 1: Allied Electronics; Supplier Part Number 1: 70202889; Manufacturer: Vishay; Manufacturer Part Number: CRCW0603-0000Z0EA; Stock 1: 0; Mount: Surface Mount; Case/Package: 0603; Weight: 7.1E-05oz; Case Code (Metric): 1608; Case Code (Imperial): 0603; Contact Plating: Tin,Lead; Min Operating Temperature: -55°C; Max Operating Temperature: 155°C; Packaging: Tape and Reel; Package Quantity: 1; Composition: Thick Film; Number of Terminations: 2; Termination: SMD/SMT; Military Standard: Not; Max Power Dissipation: 100mW; Voltage Rating (DC): 75V; Working Voltage: 75V; Features: Automotive AEC-Q200; Length: 1.55mm; Height: 0.02inch; Width: 0.033inch; Depth: 0.85mm; Radiation Hardening: No; REACH SVHC: Unknown; Lead Free: Lead Free; ComponentLink1URL: http://www.vishay.com/docs/20035/dcrcwe3.pdf?src-supplier=Digi-Key; ComponentLink1Description: http://www.vishay.com/docs/20035/dcrcwe3.pdf?src-supplier=Digi-Key; ComponentLink2URL: http://www.farnell.com/datasheets/2310790.pdf?src-supplier=Avnet; ComponentLink2Description: http://www.farnell.com/datasheets/2310790.pdf?src-supplier=Avnet; ComponentLink3URL: http://www.vishay.com/docs/20008/dcrcw.pdf?src-supplier=Avnet+Europe; ComponentLink3Description: http://www.vishay.com/docs/20008/dcrcw.pdf?src-supplier=Avnet+Europe; ComponentLink4URL: http://www.vishay.com/docs/20035/dcrcwe3.pdf?src-supplier=Future+Electronics; ComponentLink4Description: http://www.vishay.com/docs/20035/dcrcwe3.pdf?src-supplier=Future+Electronics; ComponentLink5URL: http://www.alliedelec.com/m/d/0c934d6939ccefa68dbe0b96d821c8cf.pdf?src-supplier=Allied+Electronics; ComponentLink5Description: http://www.alliedelec.com/m/d/0c934d6939ccefa68dbe0b96d821c8cf.pdf?src-supplier=Allied+Electronics; ComponentLink6URL: https://www.distrelec.biz/Web/Downloads/a_/en/flD-CRCW-e3_data_en.pdf?mime=application%2Fpdf&src-supplier=Distrelec; ComponentLink6Description: https://www.distrelec.biz/Web/Downloads/a_/en/flD-CRCW-e3_data_en.pdf?mime=application%2Fpdf&src-supplier=Distrelec; ComponentLink7URL: http://www.farnell.com/datasheets/2310790.pdf?src-supplier=Mouser; ComponentLink7Description: http://www.farnell.com/datasheets/2310790.pdf?src-supplier=Mouser; ComponentLink8URL: http://www.farnell.com/datasheets/2310790.pdf?src-supplier=Element14; ComponentLink8Description: http://www.farnell.com/datasheets/2310790.pdf?src-supplier=Element14; ComponentLink9URL: http://www.farnell.com/datasheets/125364.pdf?src-supplier=Element14; ComponentLink9Description: http://www.farnell.com/datasheets/125364.pdf?src-supplier=Element14
R14 = CRCW06032K20FKEAC: RES SMD 2.2K 0603 1% 1/10W; Manufacturer: Vishay Semiconductors; Resistance: 2.2kR; Power Rating: 100mW; Temperature Coefficient: 100ppm/°C; Supplier 1: Digi-Key; Supplier Part Number 1: 541-4022-1-ND; Manufacturer Part Number: CRCW06032K20FKEAC; Stock 1: 175447; Pricing 1: 1=0.1, 10=0.036, 100=0.0146, 1000=0.0065, 2500=0.0057 (USD); Mount: Surface Mount; Case/Package: Molded; Contact Plating: Tin; Min Operating Temperature: -55°C; Max Operating Temperature: 155°C; Composition: Thick Film; Termination: Wraparound; Tolerance: 1%; Length: 1.55mm; Lead Free: Lead Free; ComponentLink1URL: http://www.vishay.com/docs/20035/dcrcwe3.pdf?src-supplier=Avnet+Asia; ComponentLink1Description: http://www.vishay.com/docs/20035/dcrcwe3.pdf?src-supplier=Avnet+Asia; ComponentLink2URL: http://www.vishay.com/docs/28773/crcwce3.pdf?src-supplier=Digi-Key; ComponentLink2Description: http://www.vishay.com/docs/28773/crcwce3.pdf?src-supplier=Digi-Key
R16 = CRCW0603499RFKEAHP: RES SMD 499 0603 1% 1/4W; Manufacturer: Vishay Dale; Power Rating: 250mW; Voltage Rating: 75V; Temperature Coefficient: 100ppm/°C; Supplier 1: Digi-Key; Supplier Part Number 1: 541-499SCT-ND; Manufacturer Part Number: CRCW0603499RFKEAHP; Stock 1: 127078; Pricing 1: 1=0.18, 10=0.149, 100=0.0581, 1000=0.0243, 2500=0.0223 (USD); Case/Package: 0603; Weight: 7.1E-05oz; Case Code (Metric): 1608; Case Code (Imperial): 0603; Contact Plating: Tin; Min Operating Temperature: -55°C; Max Operating Temperature: 155°C; Resistance: 499R; Tolerance: 1%; Packaging: Tape and Reel; Package Quantity: 10; Composition: Thick Film; Number of Terminations: 2; Termination: SMD/SMT; Military Standard: Not; Max Power Dissipation: 250mW; Features: Automotive AEC-Q200; Length: 1.6mm; Height: 0.45mm; Width: 0.033inch; Depth: 0.85mm; Radiation Hardening: No; Lead Free: Lead Free; ComponentLink1URL: http://www.vishay.com/docs/20043/crcwhpe3.pdf?src-supplier=Digi-Key; ComponentLink1Description: http://www.vishay.com/docs/20043/crcwhpe3.pdf?src-supplier=Digi-Key; ComponentLink2URL: http://www.mouser.com/ds/2/427/crcwhpe3-46056.pdf?src-supplier=Mouser; ComponentLink2Description: http://www.mouser.com/ds/2/427/crcwhpe3-46056.pdf?src-supplier=Mouser; ComponentLink3URL: http://www.vishay.com/docs/20043/crcwhpe3.pdf?src-supplier=Avnet; ComponentLink3Description: http://www.vishay.com/docs/20043/crcwhpe3.pdf?src-supplier=Avnet
SW1 SW2 = PTS820J25MSMTRLFS: SWITCH TACT SPST-NO 0.05A 12V; Manufacturer: ITT C&K; Mechanical Life: 200000Cycles; Operating Force: 160gf; Current Rating: 50mA; Illumination Type: Non-Illuminated; Throw Configuration: SPST; Switch Travel: 0.2mm; Switch Function: Off-Mom; Actuator Type: Standard; Supplier 1: Digi-Key; Supplier Part Number 1: CKN10839CT-ND; Manufacturer Part Number: PTS820J25MSMTRLFS; Stock 1: 9227; Pricing 1: 1=0.51, 10=0.489, 25=0.4804, 50=0.4622, 100=0.3988, 250=0.3625, 500=0.3444, 1000=0.2719 (USD); Mount: Surface Mount; Color: Silver; Contact Plating: Silver; Min Operating Temperature: -40°C; Max Operating Temperature: 85°C; Package Quantity: 2300; Packaging: Tape and Reel; Voltage Rating (DC): 12V
U1 = IC CH340G USB to serial chip
U2 = CD143A-SR05: TVS DIODE 5V 20V SOT143; Manufacturer: Bourns; Direction: Unidirectional; Reverse Breakdown Voltage: 6V; Number of Elements: 1; Capacitance: 10pF; Number of Bidirectional Channels: 2; Peak Pulse Power: 500W; Power Line Protection: Yes; Leakage Current: 5uA; Peak Pulse Current: 30A; Test Current: 1mA; Element Configuration: Dual; Supplier 1: Digi-Key; Supplier Part Number 1: CD143A-SR05CT-ND; Manufacturer Part Number: CD143A-SR05; Stock 1: 13371; Pricing 1: 1=0.93, 10=0.836, 25=0.7932, 100=0.6515, 250=0.609, 500=0.5382, 1000=0.4249 (USD); Mount: Surface Mount; Case/Package: SOT-143; Number of Pins: 4; Contact Plating: Tin; Min Operating Temperature: -55°C; Max Operating Temperature: 150°C; Package Quantity: 1; Packaging: Tape and Reel; Reverse Standoff Voltage: 5V; Min Breakdown Voltage: 6V; Clamping Voltage: 20V; Polarity: Unidirectional; Number of Channels: 2; Breakdown Voltage: 6V; Termination: SMD/SMT; Max Power Dissipation: 500W; Working Voltage: 5V; ESD Protection: Yes; Power Dissipation: 500W; Max Breakdown Voltage: 6V; Max Reverse Leakage Current: 5uA; Length: 3.04mm; Height: 0.045inch; Width: 0.055inch; Depth: 1.39mm; Radiation Hardening: No; REACH SVHC: No SVHC; ComponentLink1URL: https://www.verical.com/server-webapp/html/getDatasheet?partID=29449&src-supplier=Verical; ComponentLink1Description: https://www.verical.com/server-webapp/html/getDatasheet?partID=29449&src-supplier=Verical; ComponentLink2URL: http://www.farnell.com/datasheets/1671020.pdf?src-supplier=Farnell; ComponentLink2Description: http://www.farnell.com/datasheets/1671020.pdf?src-supplier=Farnell; ComponentLink3URL: https://www.bourns.com/docs/Product-Datasheets/CD143A-SR05_12.pdf?src-supplier=Digi-Key; ComponentLink3Description: https://www.bourns.com/docs/Product-Datasheets/CD143A-SR05_12.pdf?src-supplier=Digi-Key; ComponentLink4URL: http://www.farnell.com/datasheets/1671020.pdf?src-supplier=Element14; ComponentLink4Description: http://www.farnell.com/datasheets/1671020.pdf?src-supplier=Element14; ComponentLink5URL: http://www.bourns.com/docs/Product-Datasheets/CD143A-SR05_12.pdf?src-supplier=Digi-Key; ComponentLink5Description: http://www.bourns.com/docs/Product-Datasheets/CD143A-SR05_12.pdf?src-supplier=Digi-Key; ComponentLink6URL: http://www.bourns.com/pdfs/CD143A-SR05_12.pdf?src-supplier=Avnet+Europe; ComponentLink6Description: http://www.bourns.com/pdfs/CD143A-SR05_12.pdf?src-supplier=Avnet+Europe; ComponentLink7URL: http://www.bourns.com/pdfs/CD143A-SR05_12.pdf?src-supplier=Avnet; ComponentLink7Description: http://www.bourns.com/pdfs/CD143A-SR05_12.pdf?src-supplier=Avnet; ComponentLink8URL: http://www.mouser.com/ds/2/54/D143A-SR05_12-777248.pdf?src-supplier=Mouser; ComponentLink8Description: http://www.mouser.com/ds/2/54/D143A-SR05_12-777248.pdf?src-supplier=Mouser
U3 = ESP8266EX: IC ESP8266EX, QFN32-PIN, 5_5; Manufacturer: Espressif Systems; Interface: I2C,SPI,UART; Frequency: 2.4GHz; Data Rate: 54Mbps; Sensitivity: -91dBm; Number of GPIO: 8; Current - Receiving: 56mA; Current - Transmitting: 170mA; Supplier 1: Digi-Key; Supplier Part Number 1: 1904-1001-1-ND; Manufacturer Part Number: ESP8266EX; Stock 1: 4908; Pricing 1: 1=1.6 (USD); Packaging: Cut Tape; ComponentLink1URL: https://www.espressif.com/sites/default/files/documentation/esp8266_quick_start_guide_en.pdf?src-supplier=Digi-Key; ComponentLink1Description: https://www.espressif.com/sites/default/files/documentation/esp8266_quick_start_guide_en.pdf?src-supplier=Digi-Key
U4 U5 = MMSS8050-H-TP: TRANS NPN 25V 1.5A SOT23; Manufacturer: MCC; hFE Min: 120; Max Power Dissipation: 625mW; Collector Emitter Voltage (VCEO): 500mV; Collector Base Voltage (VCBO): 40V; Emitter Base Voltage (VEBO): 5V; Transition Frequency: 100MHz; Element Configuration: Single; Supplier 1: Digi-Key; Supplier Part Number 1: MMSS8050-H-TPMSCT-ND; Manufacturer Part Number: MMSS8050-H-TP; Stock 1: 77779; Mount: Surface Mount; Case/Package: SOT-23; Number of Pins: 3; Min Operating Temperature: -55°C; Max Operating Temperature: 150°C; Packaging: Tape and Reel; Package Quantity: 3000; Polarity: NPN; Collector Emitter Saturation Voltage: 500mV; Max Collector Current: 1.5A; Collector Emitter Breakdown Voltage: 25V; Max Breakdown Voltage: 25V; Gain Bandwidth Product: 100MHz; Lead Free: Lead Free; ComponentLink1URL: http://www.mouser.com/ds/2/258/MMSS8050-255048.pdf?src-supplier=Mouser; ComponentLink1Description: http://www.mouser.com/ds/2/258/MMSS8050-255048.pdf?src-supplier=Mouser; ComponentLink2URL: http://www.mccsemi.com/up_pdf/MMSS8050(SOT-23).pdf?src-supplier=Digi-Key; ComponentLink2Description: http://www.mccsemi.com/up_pdf/MMSS8050(SOT-23).pdf?src-supplier=Digi-Key